# Altium schematic sheet M12_ETH_CONN.SchDoc: =project_title
size Tabloid; CompanyName: Luxonis Holding; Organization: Luxonis Holding; Address1: 1925 Harmony Park Drive; Address2: Westminster, CO; Address3: 80234; Address4: United States; SheetNumber: 6; SheetTotal: 8
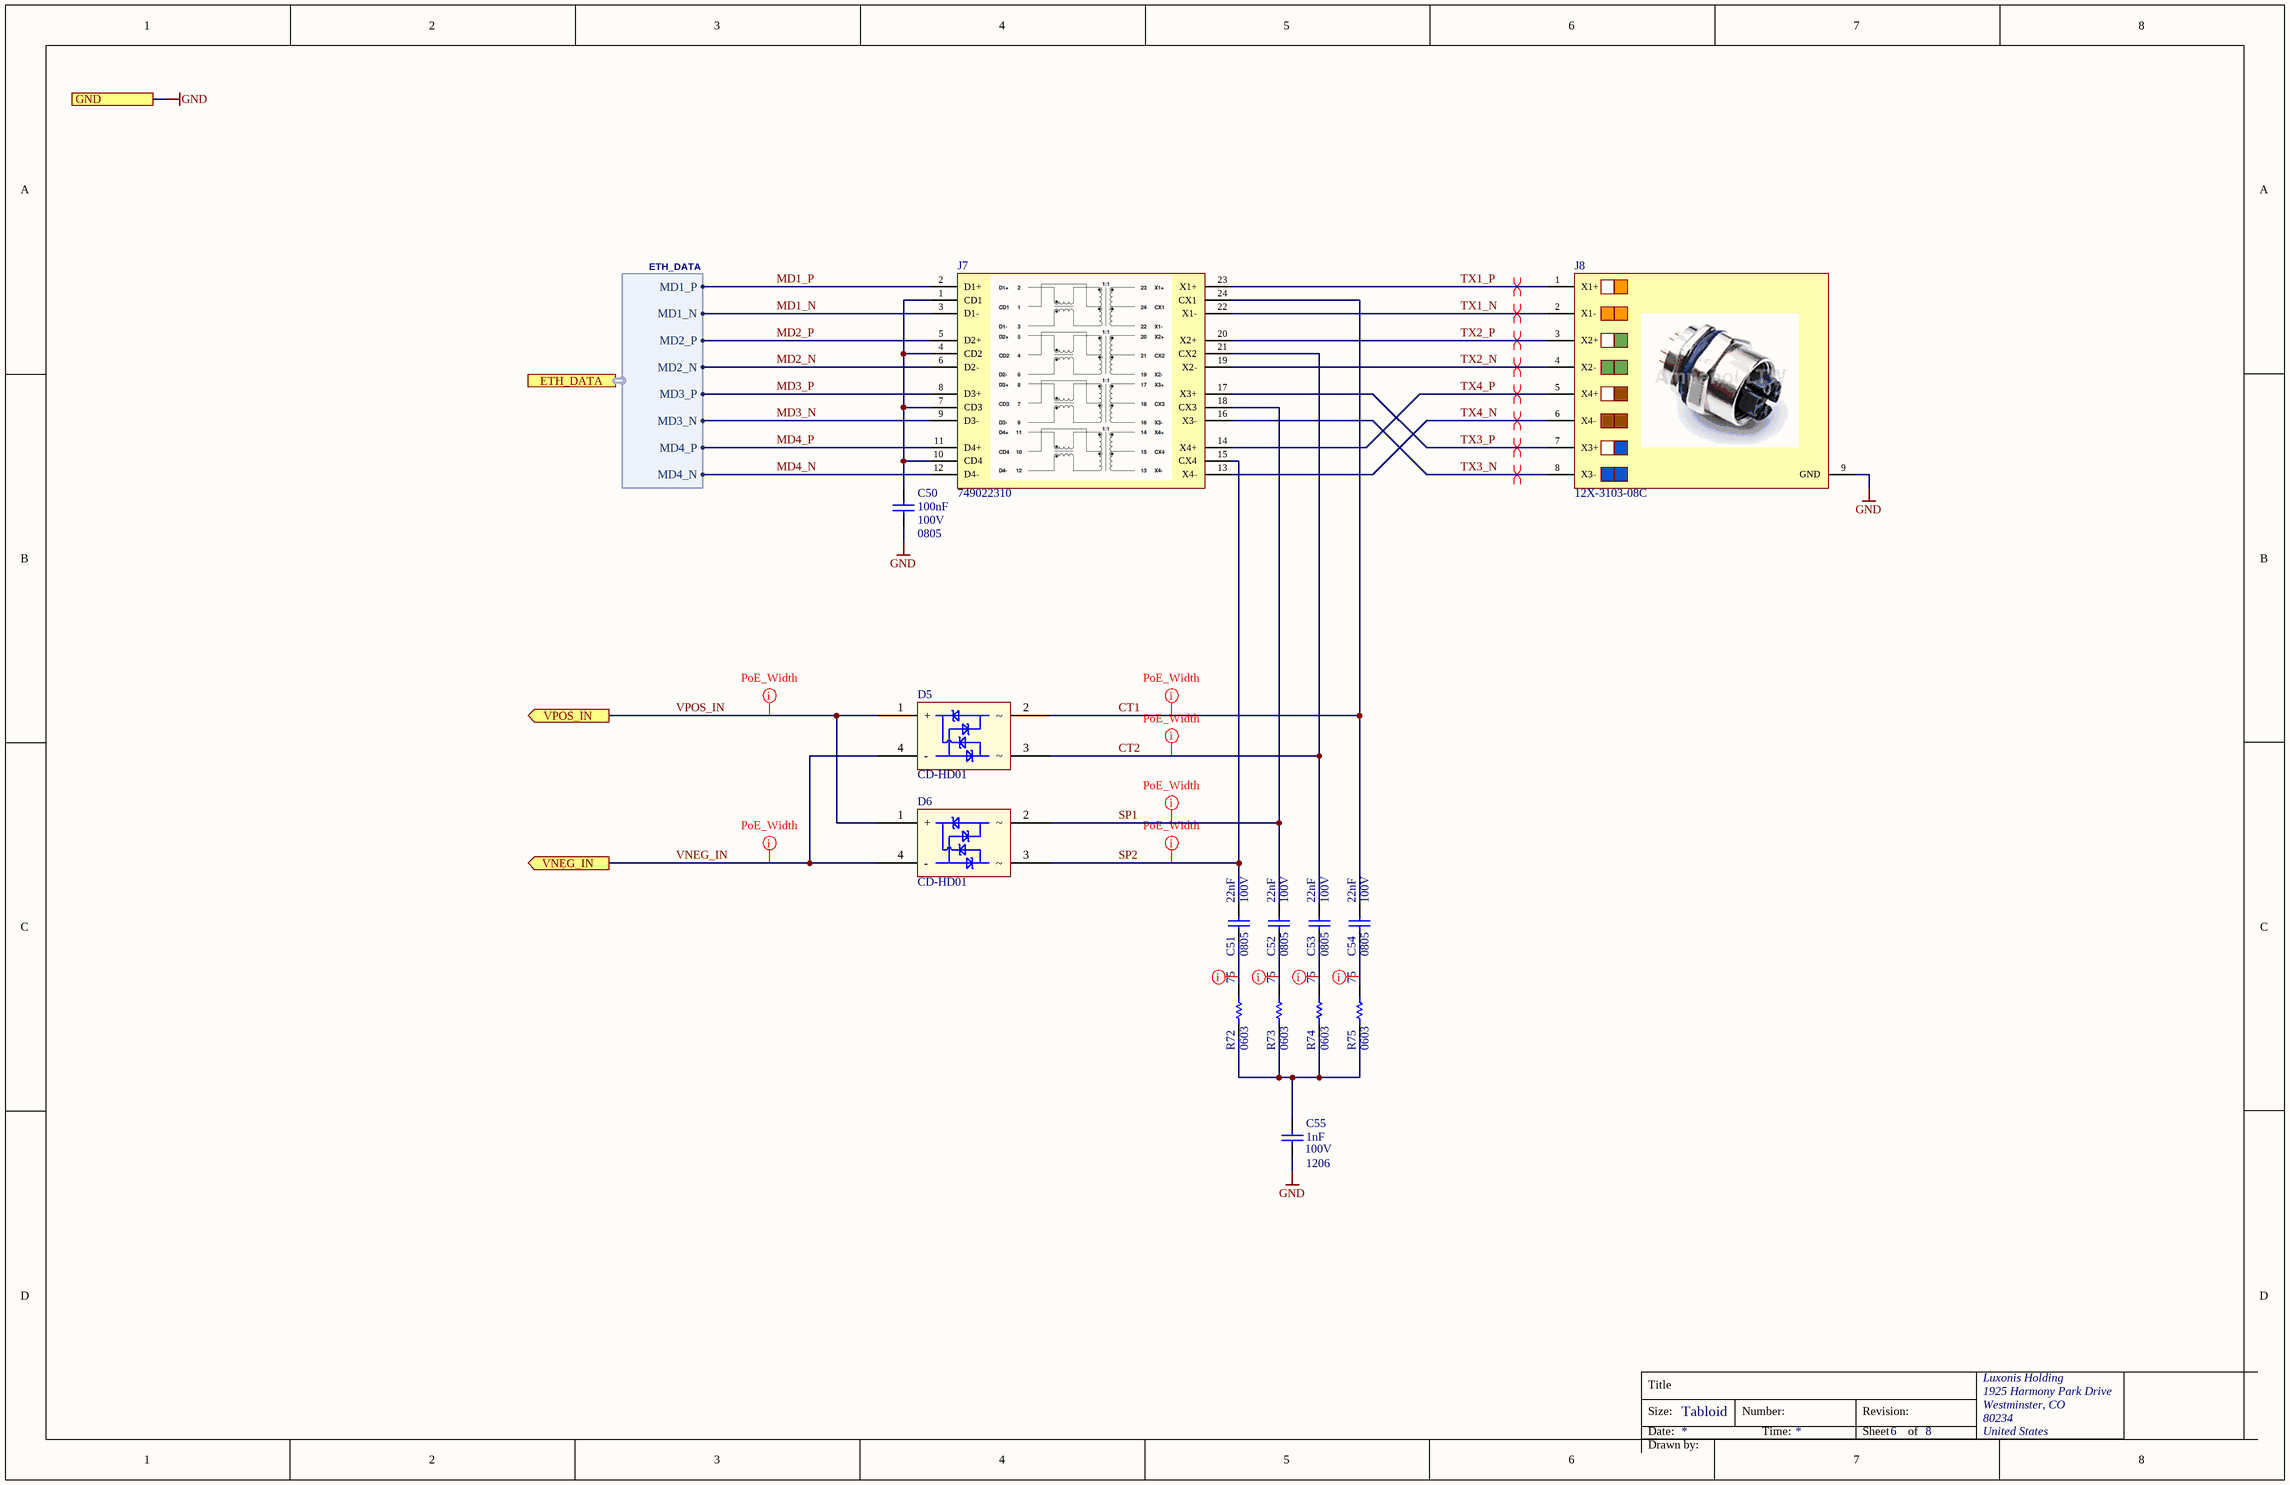
[diagram p0: M12_ETH_CONN.SchDoc]

## Parts
C50  value 100nF  Voltage Rating: 100V  Case/Package: 0805  [CAPC0805(2012)145_N]  (hidden comment: CL21B104KCFNNNE)
C51  value 22nF  Voltage Rating: 100V  Case/Package: 0805  [CAPC0805(2012)145_L]  (hidden comment: C0805C223M1RACAUTO)
C52  value 22nF  Voltage Rating: 100V  Case/Package: 0805  [CAPC0805(2012)145_L]  (hidden comment: C0805C223M1RACAUTO)
C53  value 22nF  Voltage Rating: 100V  Case/Package: 0805  [CAPC0805(2012)145_L]  (hidden comment: C0805C223M1RACAUTO)
C54  value 22nF  Voltage Rating: 100V  Case/Package: 0805  [CAPC0805(2012)145_L]  (hidden comment: C0805C223M1RACAUTO)
C55  value 1nF  Voltage Rating: 100V  Case/Package: 1206  [CAPC1206(3216)130_L]  (hidden comment: C1206C102KGRACTU)
D5  CD-HD01  [CD-H01]
D6  CD-HD01  [CD-H01]
J7  749022310  [749022310]
J8  12X-3103-08C  [12X-3103-08C]
R72  value 75  Case/Package: 0603  [RESC0603(1608)_N]  (hidden comment: ERJ-UP3F75R0V)
R73  value 75  Case/Package: 0603  [RESC0603(1608)_N]  (hidden comment: ERJ-UP3F75R0V)
R74  value 75  Case/Package: 0603  [RESC0603(1608)_N]  (hidden comment: ERJ-UP3F75R0V)
R75  value 75  Case/Package: 0603  [RESC0603(1608)_N]  (hidden comment: ERJ-UP3F75R0V)

## Ports
ETH_DATA (harness ETH_DATA), GND, VNEG_IN (out), VPOS_IN (out)

## Harnesses
ETH_DATA: MD1_P, MD1_N, MD2_P, MD2_N, MD3_P, MD3_N, MD4_P, MD4_N

## Nets
GND: C50.1 C55.1 J8.9(GND) ; port GND
CT1: C54.2 D5.2 J7.24(CX1)
CT2: C53.2 D5.3 J7.21(CX2)
MD1_N: J7.3(D1-) ; port ETH_DATA.MD1_N
MD1_P: J7.2(D1+) ; port ETH_DATA.MD1_P
MD2_N: J7.6(D2-) ; port ETH_DATA.MD2_N
MD2_P: J7.5(D2+) ; port ETH_DATA.MD2_P
MD3_N: J7.9(D3-) ; port ETH_DATA.MD3_N
MD3_P: J7.8(D3+) ; port ETH_DATA.MD3_P
MD4_N: J7.12(D4-) ; port ETH_DATA.MD4_N
MD4_P: J7.11(D4+) ; port ETH_DATA.MD4_P
SP1: C52.2 D6.2 J7.18(CX3)
SP2: C51.2 D6.3 J7.15(CX4)
TX1_N: J7.22(X1-) J8.2(X1-)
TX1_P: J7.23(X1+) J8.1(X1+)
TX2_N: J7.19(X2-) J8.4(X2-)
TX2_P: J7.20(X2+) J8.3(X2+)
TX3_N: J7.16(X3-) J8.8(X3-)
TX3_P: J7.17(X3+) J8.7(X3+)
TX4_N: J7.13(X4-) J8.6(X4-)
TX4_P: J7.14(X4+) J8.5(X4+)
VNEG_IN: D5.4(-) D6.4(-) ; port VNEG_IN
VPOS_IN: D5.1(+) D6.1(+) ; port VPOS_IN
NetC50_2: C50.2 J7.1(CD1) J7.4(CD2) J7.7(CD3) J7.10(CD4)
NetC51_1: C51.1 R72.2
NetC52_1: C52.1 R73.2
NetC53_1: C53.1 R74.2
NetC54_1: C54.1 R75.2
NetC55_2: C55.2 R72.1 R73.1 R74.1 R75.1

## Layout directives
differential pair; differential pair class 100ohm: TX1_N, TX1_P, TX2_N, TX2_P, TX3_N, TX3_P, TX4_N, TX4_P
rule Width Constraint [Pref Width = 15mil    Min Width = 4mil    Max Width = 50mil]; net class PoE: CT1, CT2, NetC51_1, NetC52_1, NetC53_1, NetC54_1, SP1, SP2, VNEG_IN, VPOS_IN

## Notes on the sheet
- Title
- Size:
- Date:
- Tabloid
- Number:
- Time:
- Revision:
- Sheet
- of
- Drawn by:

## Library data of the parts
C50 = CMP-108-000003-5: CAP CER 0.1UF 100V X7R 0805 10%; Manufacturer 1: Samsung; Dielectric: X7R; Manufacturer Part Number 1: CL21B104KCFNNNE; Length: 2mm; Width: 0.049inch; Max Operating Temperature: 125°C; Mounting Technology: SMT; ComponentLink1Description: https://datasheet.ciiva.com/26936/getdatasheetpartid-781823-26936904.pdf?src-supplier=Verical; Depth: 1.25mm; Min Operating Temperature: -55°C; ComponentLink1URL: https://datasheet.ciiva.com/26936/getdatasheetpartid-781823-26936904.pdf?src-supplier=Verical; Design Item ID: CL21B104KCFNNNE; Tolerance: 10%
C51-C54 = CMP-004-000002-5: CAP CER 22nF 100V X7R 0805 20%; Manufacturer 1: KEMET; Capacitor Type: Ceramic; ComponentLink2URL: http://components.arrow.com/part/dataview/0323_00327945?src-supplier=Arrow+Europe; Manufacturer Part Number 1: C0805C223M1RACAUTO; ComponentLink2Description: http://components.arrow.com/part/dataview/0323_00327945?src-supplier=Arrow+Europe; ComponentLink5URL: https://api.kemet.com/component-edge/download/datasheet/C0805C223M1RACAUTO.pdf?src-supplier=Digi-Key; Min Operating Temperature: -55°C; Width: 1.25mm; Height: 0.9mm; Design Item ID: C0805C223M1RACAUTO; Tolerance: 20%; ComponentLink4Description: http://www.kemet.com/docfinder?Partnumber=C0805C223M1RACAUTO&src-supplier=Digi-Key; Dielectric: X7R; ComponentLink5Description: https://api.kemet.com/component-edge/download/datasheet/C0805C223M1RACAUTO.pdf?src-supplier=Digi-Key; ComponentLink3Description: http://capacitoredge.kemet.com/capedge2/DataSheet/Datasheet-C0805C223M1RACAUTO.pdf?pn=C0805C223M1RACAUTO&src-supplier=Avnet; ComponentLink4URL: http://www.kemet.com/docfinder?Partnumber=C0805C223M1RACAUTO&src-supplier=Digi-Key; Mounting Technology: SMT; ComponentLink3URL: http://capacitoredge.kemet.com/capedge2/DataSheet/Datasheet-C0805C223M1RACAUTO.pdf?pn=C0805C223M1RACAUTO&src-supplier=Avnet; ComponentLink1URL: https://datasheet.ciiva.com:443/pdfs/VipMasterIC/IC/KEME/KEME-S-A0009891634/KEME-S-A0009891634-1.pdf?src-supplier=IHS+Markit; ComponentLink1Description: https://datasheet.ciiva.com:443/pdfs/VipMasterIC/IC/KEME/KEME-S-A0009891634/KEME-S-A0009891634-1.pdf?src-supplier=IHS+Markit; Length: 2mm; Max Operating Temperature: 125°C
C55 = CMP-004-000001-5: CAP CER 1nF 2000V X7R 1206 10%; Manufacturer 1: KEMET; Capacitor Type: Ceramic; Manufacturer Part Number 1: C1206C102KGRACTU; Min Operating Temperature: -55°C; Height: 1.6mm; ComponentLink2URL: https://datasheet.ciiva.com/18194/getdatasheetpartid-359031-18194095.pdf?src-supplier=Verical; ComponentLink4URL: https://datasheet.ciiva.com/28672/1807957-28672854.pdf?src-supplier=Element14; ComponentLink1Description: https://datasheet.ciiva.com:443/pdfs/VipMasterIC/IC/KEME/KEME-S-A0007617657/KEME-S-A0007567533-1.pdf?src-supplier=IHS+Markit; ComponentLink2Description: https://datasheet.ciiva.com/18194/getdatasheetpartid-359031-18194095.pdf?src-supplier=Verical; Dielectric: X7R; Width: 1.6mm; Length: 3.2mm; ComponentLink1URL: https://datasheet.ciiva.com:443/pdfs/VipMasterIC/IC/KEME/KEME-S-A0007617657/KEME-S-A0007567533-1.pdf?src-supplier=IHS+Markit; Design Item ID: C1206C102KGRACTU; ComponentLink3Description: https://datasheet.ciiva.com/28610/1372242-28610895.pdf?src-supplier=Element14; Max Operating Temperature: 125°C; ComponentLink4Description: https://datasheet.ciiva.com/28672/1807957-28672854.pdf?src-supplier=Element14; ComponentLink3URL: https://datasheet.ciiva.com/28610/1372242-28610895.pdf?src-supplier=Element14; Mounting Technology: SMT; Tolerance: 10%
D5 D6 = CMP-004-00050-1: CD-HD0x Series Schottky Bridge Rectifier Diode 100V 4-Pin Surface Mount T/R; Manufacturer 1: Bourns; Average Rectified Current: 1A; Source: NG9097_test.SchLib; RoHS: No; Pricing 1: 1=0.61000, 10=0.52500, 100=0.36400, 500=0.28420, 1000=0.23100, 2000=0.21700 (USD); Packaging: Tape and Reel; Mount: Surface Mount; Design Item ID: CD-HD01; Stock 1: 15383; Min Operating Temperature: -55°C; Manufacturer Part Number 1: CD-HD01; Max Operating Temperature: 125°C
J7 = CMP-012-00001-3: WE-LAN AQ SMT Transformer, 1000 Base-T, PoE+ (up to 720 mA), 150uH; Manufacturer 1: Wurth Elektronik; Manufacturer Part Number 1: 749022310; Design Item ID: 749022310
J8 = CMP-002-00115-2: Conn M12 Circular F 8 POS Solder ST Thru-Hole 8 Terminal 1 Port; Manufacturer 1: KingTop; Stock 1: 703; ComponentLink1URL: http://www.farnell.com/datasheets/1945922.pdf?src-supplier=Element14; ComponentLink1Description: http://www.farnell.com/datasheets/1945922.pdf?src-supplier=Element14; Source: NG9097.SchLib; Manufacturer Part Number 1: 12X-3103-08C; Pins: 8; Pricing 1: 1=10,44000, 10=9,39800, 25=8,85280, 50=8,62600, 100=8,39900, 250=7,49100, 500=7,03700, 1000=6,35600 (USD); RoHS: No; Design Item ID: 12X-3103-08C; ComponentLink2Description: http://www.farnell.com/datasheets/1879376.pdf?src-supplier=Element14; ComponentLink2URL: http://www.farnell.com/datasheets/1879376.pdf?src-supplier=Element14; Category: Circular Connectors
R72-R75 = CMP-013-000003-8: RES SMD 75 OHM 150V 1% 1/10W 0603; Manufacturer 1: Panasonic; Manufacturer Part Number 1: ERJ-UP3F75R0V; Design Item ID: ERJ-UP3F75R0V